# Altium schematic sheet GMSL_SERIALIZER.SchDoc
size C; SheetNumber: 2; SheetTotal: 4
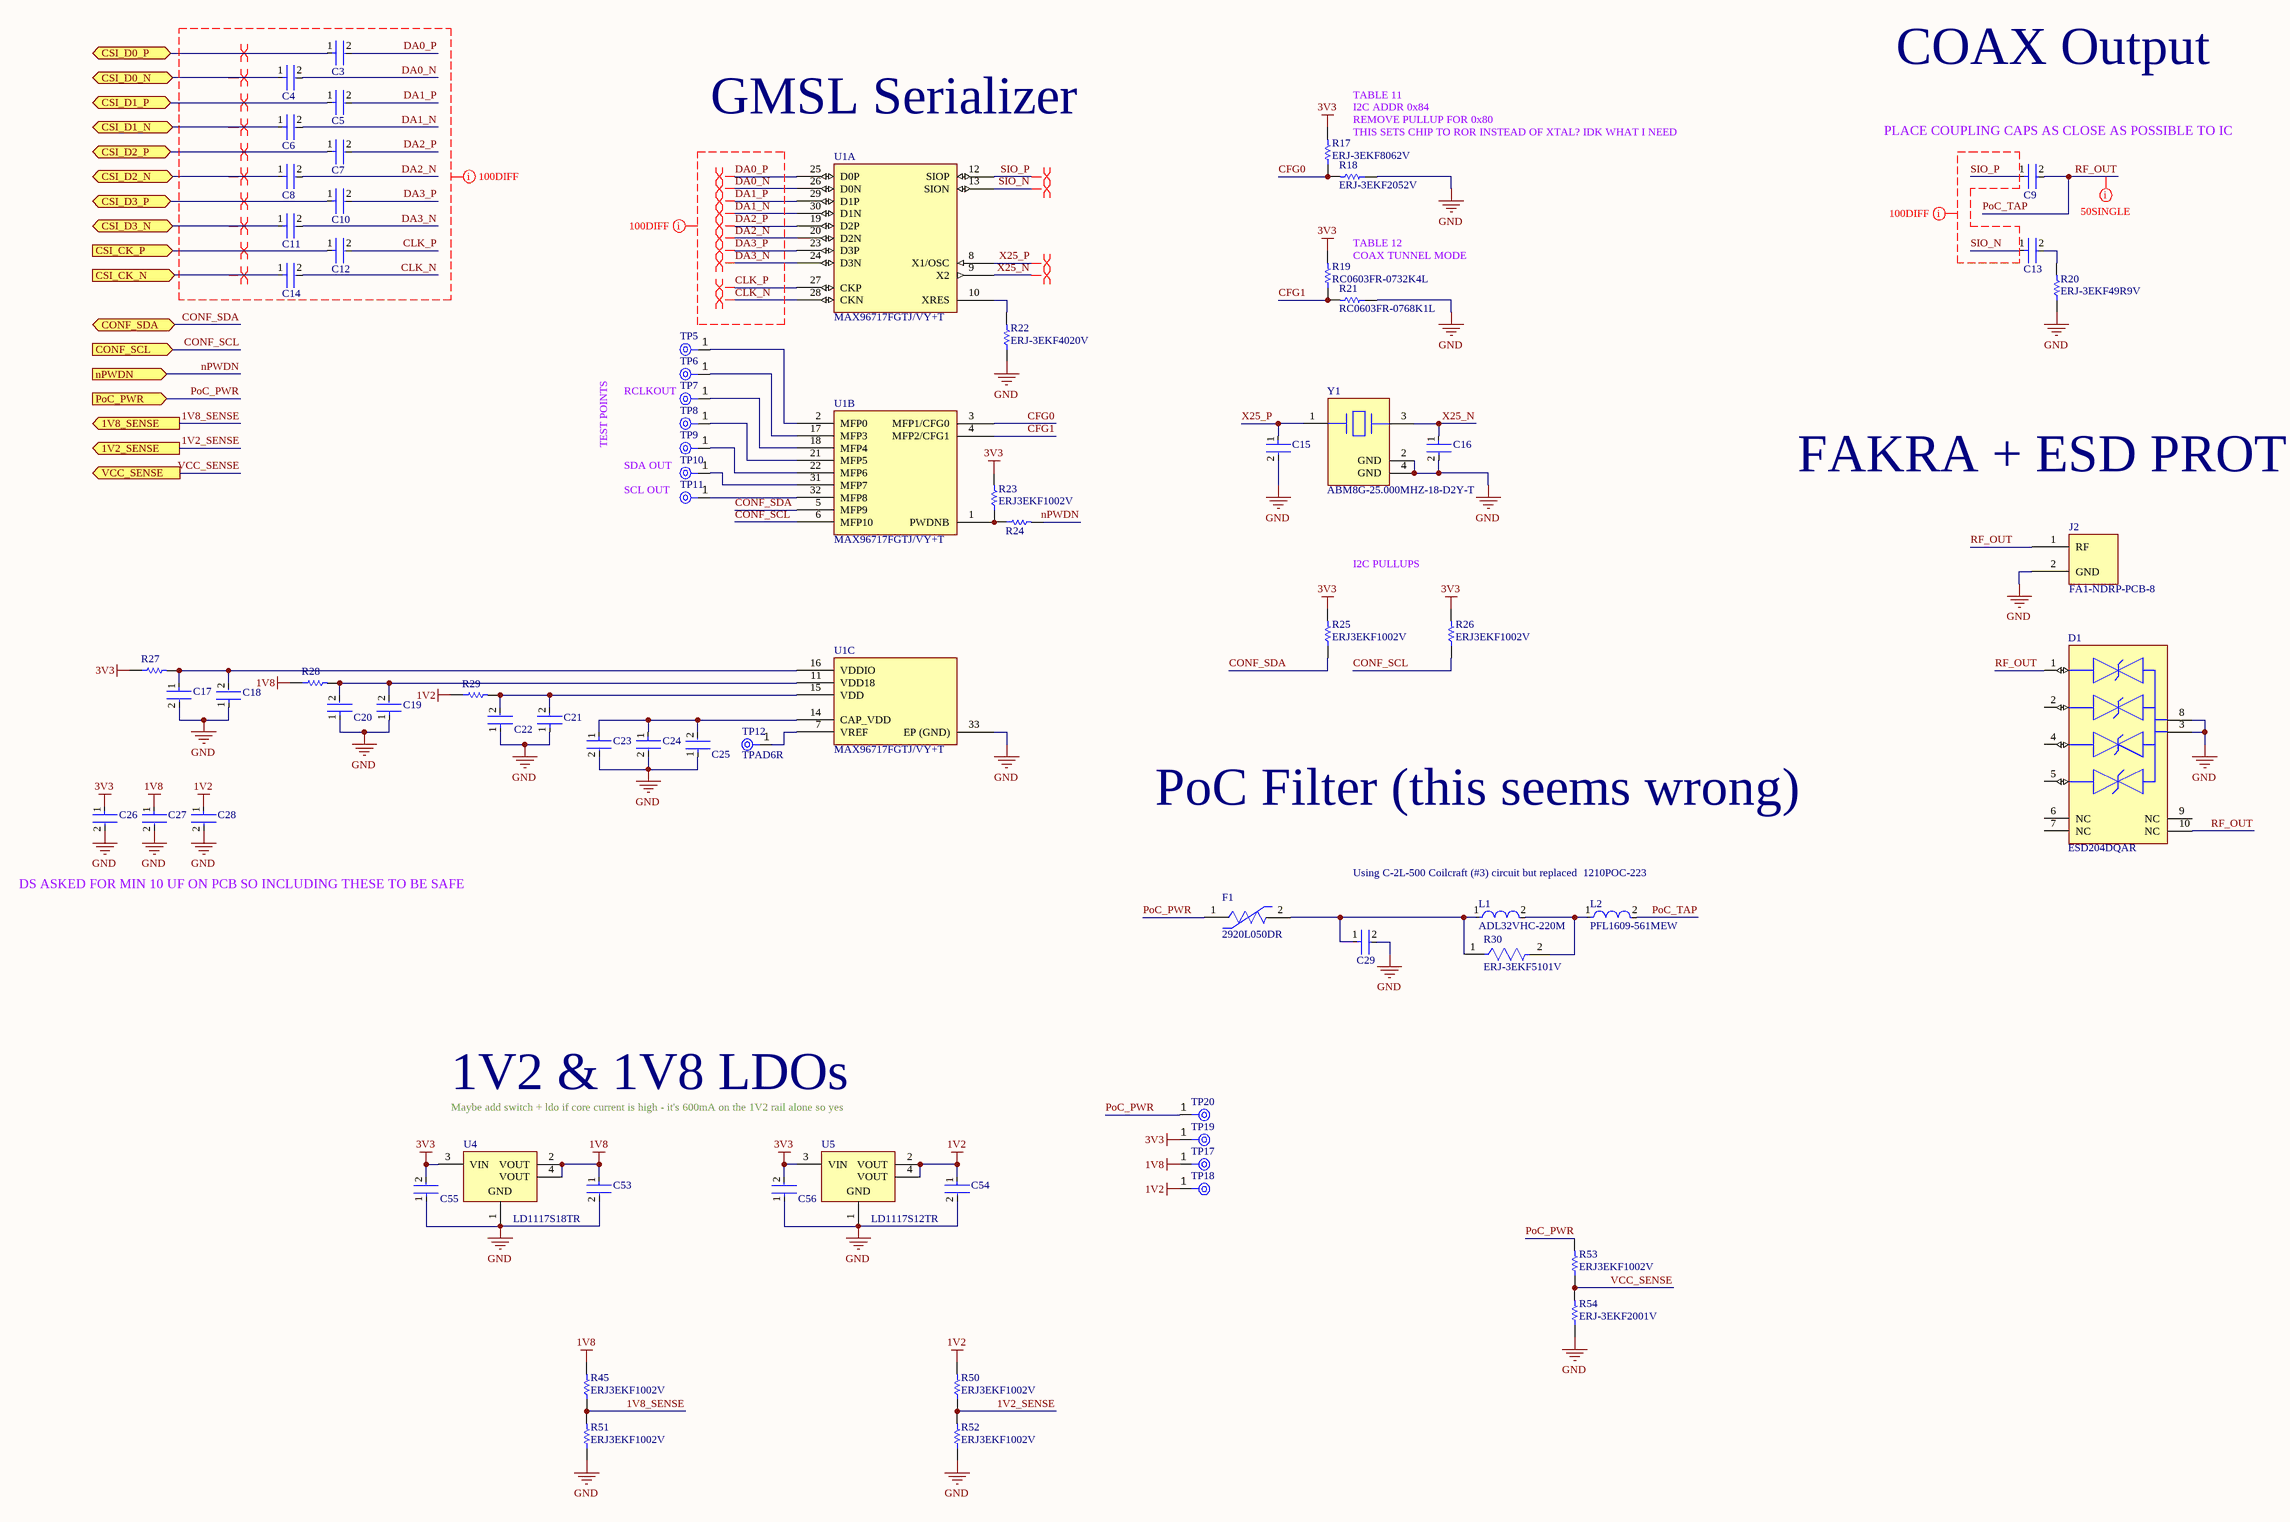
[diagram p0: GMSL_SERIALIZER.SchDoc]

## Parts
C3  C1005X7R1H104K050BB  [FP-C1005-050-0_05-IPC_C]  (value not drawn)
C4  C1005X7R1H104K050BB  [FP-C1005-050-0_05-IPC_C]  (value not drawn)
C5  C1005X7R1H104K050BB  [FP-C1005-050-0_05-IPC_C]  (value not drawn)
C6  C1005X7R1H104K050BB  [FP-C1005-050-0_05-IPC_C]  (value not drawn)
C7  C1005X7R1H104K050BB  [FP-C1005-050-0_05-IPC_C]  (value not drawn)
C8  C1005X7R1H104K050BB  [FP-C1005-050-0_05-IPC_C]  (value not drawn)
C9  C1005X7R1H104K050BB  [FP-C1005-050-0_05-IPC_C]  (value not drawn)
C10  C1005X7R1H104K050BB  [FP-C1005-050-0_05-IPC_C]  (value not drawn)
C11  C1005X7R1H104K050BB  [FP-C1005-050-0_05-IPC_C]  (value not drawn)
C12  C1005X7R1H104K050BB  [FP-C1005-050-0_05-IPC_C]  (value not drawn)
C13  C1005X7R1H104K050BB  [FP-C1005-050-0_05-IPC_C]  (value not drawn)
C14  C1005X7R1H104K050BB  [FP-C1005-050-0_05-IPC_C]  (value not drawn)
C15  C0603C300J5GACTU  [FP-C0603C-CF-MFG]  (value not drawn)
C16  C0603C300J5GACTU  [FP-C0603C-CF-MFG]  (value not drawn)
C17  CL05A106MP5NUNC  [FP-CL05A106MP5NUNC-MFG]  (value not drawn)
C18  C0402C103M5RACTU  [FP-C0402-BB-MFG]  (value not drawn)
C19  C0402C103M5RACTU  [FP-C0402-BB-MFG]  (value not drawn)
C20  C1005X7R1H104K050BB  [FP-C1005-050-0_05-IPC_C]  (value not drawn)
C21  C0402C103M5RACTU  [FP-C0402-BB-MFG]  (value not drawn)
C22  C1005X7R1H104K050BB  [FP-C1005-050-0_05-IPC_C]  (value not drawn)
C23  CL05A106MP5NUNC  [FP-CL05A106MP5NUNC-MFG]  (value not drawn)
C24  CL05A106MP5NUNC  [FP-CL05A106MP5NUNC-MFG]  (value not drawn)
C25  C1005X7R1H104K050BB  [FP-C1005-050-0_05-IPC_C]  (value not drawn)
C26  CL05A106MP5NUNC  [FP-CL05A106MP5NUNC-MFG]  (value not drawn)
C27  CL05A106MP5NUNC  [FP-CL05A106MP5NUNC-MFG]  (value not drawn)
C28  CL05A106MP5NUNC  [FP-CL05A106MP5NUNC-MFG]  (value not drawn)
C29  GRM21BR61E226ME44L  [FP-GRM21B-0_2-e0_2_0_7-IPC_B]  (value not drawn)
C53  GRM188R60J106ME47D  [FP-GRM188-0_1-e0_2_0_55-IPC_A]  (value not drawn)
C54  GRM188R60J106ME47D  [FP-GRM188-0_1-e0_2_0_55-IPC_A]  (value not drawn)
C55  C1005X7R1H104K050BB  [FP-C1005-050-0_05-IPC_C]  (value not drawn)
C56  C1005X7R1H104K050BB  [FP-C1005-050-0_05-IPC_C]  (value not drawn)
D1  ESD204DQAR  [FP-DQA0010A-MFG]
F1  2920L050DR  [FP-2920L050DR-MFG]
J2  FA1-NDRP-PCB-8  [FA1-NDRP-PCB-8-Footprint-1]
L1  ADL32VHC-220M  [FP-1210POC-MFG]
L2  PFL1609-561MEW  [FP-PFL1609-MFG]
R17  ERJ-3EKF8062V  [RESC1608X55X30LL15T15]
R18  ERJ-3EKF2052V  [RESC1608X55X30NL15T15]
R19  RC0603FR-0732K4L  [RESC1608X55X25ML10T15]
R20  ERJ-3EKF49R9V  [RESC1608X55X30ML15T15]
R21  RC0603FR-0768K1L  [RESC1608X55X25LL10T15]
R22  ERJ-3EKF4020V  [RESC1608X55X30LL15T15]
R23  ERJ3EKF1002V  [RESC1609X55X30LL15T15]
R24  0402 JUMPER  [RESC1005X40X25ML05T05]  (value not drawn)
R25  ERJ3EKF1002V  [RESC1609X55X30LL15T15]
R26  ERJ3EKF1002V  [RESC1609X55X30LL15T15]
R27  RC0402JR-070RL  [RESC1005X40X25NL05T10]  (value not drawn)
R28  RC0402JR-070RL  [RESC1005X40X25NL05T10]  (value not drawn)
R29  RC0402JR-070RL  [RESC1005X40X25NL05T10]  (value not drawn)
R30  ERJ-3EKF5101V  [FP-ERJ3EK-MFG]
R45  ERJ3EKF1002V  [RESC1609X55X30LL15T15]
R50  ERJ3EKF1002V  [RESC1609X55X30LL15T15]
R51  ERJ3EKF1002V  [RESC1609X55X30LL15T15]
R52  ERJ3EKF1002V  [RESC1609X55X30LL15T15]
R53  ERJ3EKF1002V  [RESC1609X55X30LL15T15]
R54  ERJ-3EKF2001V  [RESC1608X55X30ML15T15]
TP5  TPAD6R  [New footprint 1]  (value not drawn)
TP6  TPAD6R  [New footprint 1]  (value not drawn)
TP7  TPAD6R  [New footprint 1]  (value not drawn)
TP8  TPAD6R  [New footprint 1]  (value not drawn)
TP9  TPAD6R  [New footprint 1]  (value not drawn)
TP10  TPAD6R  [New footprint 1]  (value not drawn)
TP11  TPAD6R  [New footprint 1]  (value not drawn)
TP12  TPAD6R  [New footprint 1]
TP17  TPAD6R  [New footprint 1]  (value not drawn)
TP18  TPAD6R  [New footprint 1]  (value not drawn)
TP19  TPAD6R  [New footprint 1]  (value not drawn)
TP20  TPAD6R  [New footprint 1]  (value not drawn)
U1  MAX96717FGTJ/VY+T  [QFN50P500X500X80_HS-33N]  (parts A,B,C of 3)
U4  LD1117S18TR  [SOT-223_M]
U5  LD1117S12TR  [SOT-223_M]
Y1  ABM8G-25.000MHZ-18-D2Y-T  [FP-ABM8G-MFG]

## Ports
1V2_SENSE (out, see CamLink[4B], CONFIG_MCU[6A]), 1V8_SENSE (out, see CamLink[4B], CONFIG_MCU[6A]), CONF_SCL (in, see CamLink[4B]), CONF_SDA (bidir, see CamLink[4B]), CSI_CK_N (in, see CamLink[4B]), CSI_CK_P (in, see CamLink[4B]), CSI_D0_N (bidir, see CamLink[4A]), CSI_D0_P (bidir, see CamLink[4A]), CSI_D1_N (bidir, see CamLink[4A]), CSI_D1_P (bidir, see CamLink[4A]), CSI_D2_N (bidir, see CamLink[4A]), CSI_D2_P (bidir, see CamLink[4A]), CSI_D3_N (bidir, see CamLink[4A]), CSI_D3_P (bidir, see CamLink[4A]), nPWDN (in, see CamLink[4B]), PoC_PWR (in, see CamLink[4B]), VCC_SENSE (out, see CamLink[4B], CONFIG_MCU[6A])

## Nets
1V2: C28.1 C54.1 R29.1 R50.2 TP18.1(TP) U5.2(VOUT) U5.4(VOUT)
1V8: C27.1 C53.1 R28.1 R45.2 TP17.1(TP) U4.2(VOUT) U4.4(VOUT)
3V3: C26.1 C55.2 C56.2 R17.2 R19.2 R23.2 R25.2 R26.2 R27.1 TP19.1(TP) U4.3(VIN) U5.3(VIN)
GND: C15.2 C16.2 C17.2 C18.1 C19.1 C20.1 C21.1 C22.1 C23.2 C24.2 C25.1 C26.2 C27.2 C28.2 C29.2 C53.2 C54.2 C55.1 C56.1 D1.3(GND) D1.8(GND) J2.2(GND) R18.1 R20.1 R21.1 R22.1 R51.1 R52.1 R54.1 U1.33(EP_(GND)) U4.1(GND) U5.1(GND) Y1.2(GND) Y1.4(GND)
1V2_SENSE: R50.1 R52.2 ; port 1V2_SENSE
1V8_SENSE: R45.1 R51.2 ; port 1V8_SENSE
CFG0: R17.1 R18.2 U1.3(MFP1/CFG0)
CFG1: R19.1 R21.2 U1.4(MFP2/CFG1)
CLK_N: C14.2 U1.28(CKN)
CLK_P: C12.2 U1.27(CKP)
CONF_SCL: R26.1 U1.6(MFP10) ; port CONF_SCL
CONF_SDA: R25.1 U1.5(MFP9) ; port CONF_SDA
CSI_CK_N: C14.1 ; port CSI_CK_N
CSI_CK_P: C12.1 ; port CSI_CK_P
CSI_D0_N: C4.1 ; port CSI_D0_N
CSI_D0_P: C3.1 ; port CSI_D0_P
CSI_D1_N: C6.1 ; port CSI_D1_N
CSI_D1_P: C5.1 ; port CSI_D1_P
CSI_D2_N: C8.1 ; port CSI_D2_N
CSI_D2_P: C7.1 ; port CSI_D2_P
CSI_D3_N: C11.1 ; port CSI_D3_N
CSI_D3_P: C10.1 ; port CSI_D3_P
DA0_N: C4.2 U1.26(D0N)
DA0_P: C3.2 U1.25(D0P)
DA1_N: C6.2 U1.30(D1N)
DA1_P: C5.2 U1.29(D1P)
DA2_N: C8.2 U1.20(D2N)
DA2_P: C7.2 U1.19(D2P)
DA3_N: C11.2 U1.24(D3N)
DA3_P: C10.2 U1.23(D3P)
nPWDN: R24.2 ; port nPWDN
PoC_PWR: F1.1 R53.2 TP20.1(TP) ; port PoC_PWR
PoC_TAP: C9.2 D1.1(IO1) D1.10(NC) J2.1(RF) L2.2  [also labelled RF_OUT]
SIO_N: C13.1 U1.13(SION)
SIO_P: C9.1 U1.12(SIOP)
VCC_SENSE: R53.1 R54.2 ; port VCC_SENSE
X25_N: C16.1 U1.9(X2) Y1.3
X25_P: C15.1 U1.8(X1/OSC) Y1.1
NetC13_2: C13.2 R20.2
NetC17_1: C17.1 C18.2 R27.2 U1.16(VDDIO)
NetC19_2: C19.2 C20.2 R28.2 U1.11(VDD18)
NetC21_2: C21.2 C22.2 R29.2 U1.15(VDD)
NetC23_1: C23.1 C24.1 C25.2 U1.14(CAP_VDD)
NetC29_1: C29.1 F1.2 L1.1 R30.1
NetL1_2: L1.2 L2.1 R30.2
NetR22_2: R22.2 U1.10(XRES)
NetR23_1: R23.1 R24.1 U1.1(PWDNB)
NetTP5_1: TP5.1(TP) U1.2(MFP0)
NetTP6_1: TP6.1(TP) U1.17(MFP3)
NetTP7_1: TP7.1(TP) U1.18(MFP4)
NetTP8_1: TP8.1(TP) U1.21(MFP5)
NetTP9_1: TP9.1(TP) U1.22(MFP6)
NetTP10_1: TP10.1(TP) U1.31(MFP7)
NetTP11_1: TP11.1(TP) U1.32(MFP8)
NetTP12_1: TP12.1(TP) U1.7(VREF)

Not connected (* = marked no-connect by the designer): D1 2(IO2) 4(IO3) 5(IO4) 6(NC) 7(NC) 9(NC)

## Layout directives
net class 100DIFF: CLK_N, CLK_P, DA0_N, DA0_P, DA1_N, DA1_P, DA2_N, DA2_P, DA3_N, DA3_P, SIO_N, SIO_P
differential pair: CLK_N, CLK_P, CSI_CK_N, CSI_CK_P, CSI_D0_N, CSI_D0_P, CSI_D1_N, CSI_D1_P, CSI_D2_N, CSI_D2_P, CSI_D3_N, CSI_D3_P, DA0_N, DA0_P, DA1_N, DA1_P, DA2_N, DA2_P, DA3_N, DA3_P, SIO_N, SIO_P, X25_N, X25_P
net class 50SINGLE: PoC_TAP

## Notes on the sheet
- COAX Output
- GMSL Serializer
- (near R17) I2C ADDR 0x84
- (near R17) REMOVE PULLUP FOR 0x80
- THIS SETS CHIP TO ROR INSTEAD OF XTAL? IDK WHAT I NEED
- (near R17) TABLE 11
- (near C9) PLACE COUPLING CAPS AS CLOSE AS POSSIBLE TO IC
- COAX TUNNEL MODE
- (near R19) TABLE 12
- TEST POINTS
- RCLKOUT
- SDA OUT
- SCL OUT
- FAKRA + ESD PROT
- I2C PULLUPS
- PoC Filter (this seems wrong)
- Using C-2L-500 Coilcraft (#3) circuit but replaced  1210POC-223
- DS ASKED FOR MIN 10 UF ON PCB SO INCLUDING THESE TO BE SAFE
- 1V2 & 1V8 LDOs
- Maybe add switch + ldo if core current is high - it's 600mA on the 1V2 rail alone so yes

## Library data of the parts
C3-C14 C20 C22 C25 C55 C56 = CMP-2000-05393-2: Multilayer Ceramic Capacitors 100nF ±10% 50V X7R SMD 0402; Voltage: 50V; Dielectric Material: Ceramic; Min Operating Temperature: -55°C; Depth: 0.5mm; Radiation Hardening: No; RoHS Compliant: Yes; Voltage Rating (DC): 50V; Lead Free: Lead Free; Resistor Type: Ceramic; Height: 0.5mm; Dielectric: X7R; Thickness: 0.022inch; Case/Package: 0402; Case Code (Metric): 1005; Termination: SMD/SMT; Capacitance: 100nF; Packaging: Tape and Reel; Max Operating Temperature: 125°C; Mount: Surface Mount; Package Quantity: 1; Width: 0.02inch; Weight: 2.3E-05oz; Voltage Rating: 50V; Tolerance: 10%; Construction: Flat; Case Code (Imperial): 0402; Length: 1mm; REACH SVHC: No SVHC; Series: C
C15 C16 = CMP-1035-00914-3: CAP CER 30PF 50V 5% NP0 0603; Manufacturer: KEMET; Automotive Grade: Grade 1; Temperature Coefficient: 30ppm/°C; Material: Ceramic; Temperature Characteristic: C0G; Tolerance: 0.05; Manufacturer Part Number: C0603C300J5GACTU; ComponentLink2URL: https://api.kemet.com/component-edge/download/datasheet/C0603C100J5GACAUTO.pdf; Automotive: Yes; Device Class L2: Capacitors; Device Class L1: Passive Components; Device Class L3: Ceramic Capacitors; RoHS: TRUE; Octopart: https://octopart.com/c0603c300j5gactu-kemet-199455; Lead Free: Yes; Value: 30 pF; Temperature Range High: +125°C; Category: Cap; Temperature: -55°C to +125°C; Package: C0603C-CF; Capacitance: 30 pF; Digikey Description: CAP CER 30PF 50V 5% NP0 0603; Height: 0.87mm; ComponentLink2Description: Datasheet; Temperature Range Low: -55°C; Mouser Description: Multilayer Ceramic Capacitors MLCC - SMD/SMT 50volts 30pF C0G 5%; Voltage Rating: 50 V
C17 C23 C24 C26-C28 = CMP-13271-000002-1: CAP CER 10UF 10V X5R 0402; Manufacturer: Samsung; Temperature Coefficient: 15%; Tolerance: 20%; Material: Ceramic; Octopart: https://octopart.com/cl05a106mp5nunc-samsung-22457395; Voltage Rating: 10V; RoHS: TRUE; Value: 10uF; Height: 0.7mm; Digikey Description: CAP CER 10UF 10V X5R 0402; Automotive: No; Package: CL05A106MP5NUNC; Device Class L1: Passive Components; Capacitance: 10uF; Temperature Range High: +85°C; ComponentLink2Description: Datasheet; Device Class L2: Capacitors; Temperature Characteristic: X5R; Manufacturer Part Number: CL05A106MP5NUNC; Temperature: -55°C to +85°C; ComponentLink2URL: http://www.samsungsem.com/kr/support/product-search/mlcc/__icsFiles/afieldfile/2019/05/10/19-CL05A106MP5NUNC.pdf; Device Class L3: Ceramic Capacitors; Category: Cap; Temperature Range Low: -55°C; Ipc Land Pattern Name: CAPC10050X50; Lead Free: Yes
C18 C19 C21 = CMP-1034-01887-3: CAP CER 10000PF 50V 20% X7R 0402; Manufacturer: Kemet; Value: 10,000 pF; Tolerance: 0.2; Temperature Coefficient: 15%; Material: Ceramic; Temperature Range Low: -55°C; Digikey Description: CAP CER 10000PF 50V 20% X7R 0402; Temperature Characteristic: X7R; Device Class L2: Capacitors; RoHS: TRUE; Temperature Range High: +125°C; Mouser Description: Cap Ceramic 0.01uF 50V X7R 20% SMD 1.0 x 0.5 mm 125 C Paper T/R; Package: C0402-BB; ComponentLink2URL: https://content.kemet.com/datasheets/KEM_C1002_X7R_SMD.pdf; Device Class L1: Passive Components; ComponentLink2Description: Datasheet; Height: 0.55mm; Automotive: No; Temperature: -55°C to +125°C; Capacitance: 10,000 pF; Manufacturer Part Number: C0402C103M5RACTU; Device Class L3: Ceramic Capacitors; Voltage Rating: 50 V; Ipc Land Pattern Name: CAPC10050X50; Category: Cap; Octopart: https://octopart.com/c0402c103m5ractu-kemet-17125571; Lead Free: Yes
C29 = CMP-2007-03222-3: Chip Multilayer Ceramic Capacitors for General Purpose, 0805, 22uF, X5R, 15%, 20%, 25V; Case/Package: 0805; Depth: 1.25mm; Resistor Type: Ceramic; Voltage Rating: 25V; Lead Free: Lead Free; Voltage Rating (DC): 25V; Case Code (Metric): 2012; Thickness: 0.057inch; REACH SVHC: No SVHC; Material: Ceramic; Tolerance: 20%; Length: 2mm; Capacitance: 22uF; Case Code (Imperial): 0805; Max Operating Temperature: 85°C; Termination: SMD/SMT; Weight: 0.000335oz; Dielectric: X5R; Packaging: Tape and Reel; Voltage: 25V; Package Quantity: 3000; Height: 1.25mm; Mount: Surface Mount; Width: 1.25mm; Min Operating Temperature: -55°C
C53 C54 = CMP-2006-02792-2: Chip Multilayer Ceramic Capacitors for General Purpose, 0603, 10uF, X5R, 15%, 20%, 6.3V; Packaging: Tape and Reel; Voltage Rating (DC): 6.3V; Width: 0.031inch; Termination: SMD/SMT; Dielectric: X5R; Package Quantity: 4000; Voltage Rating: 6.3V; Capacitance: 10uF; Case/Package: 0603; Min Operating Temperature: -55°C; Voltage: 6.3V; Length: 1.6mm; Thickness: 0.035inch; Lead Free: Lead Free; Depth: 0.8mm; Case Code (Imperial): 0603; Max Operating Temperature: 85°C; Material: Ceramic; Height: 0.8mm; Tolerance: 20%; Mount: Surface Mount; REACH SVHC: No SVHC; Radiation Hardening: No; Case Code (Metric): 1608
D1 = CMP-04989-000002-1: 4-CHANNEL LOW-CAPACITANCE SURGE; Manufacturer: Texas Instruments; Value: 0.55pF; Reverse Standoff Voltage: 3.6V; Standoff Height: 0mm; Breakdown Voltage: 5.5V; Peak Pulse Current: 5.5A; Clamping Voltage: 11.5V; Direction: Bidirectional; Peak Pulse Power: 50W; Number Of Channels: 4; Ambient Temperature Range High: +125°C; ComponentLink2Description: Datasheet; Height: 0.55mm; Lead Free: Yes; Device Class L3: unset; Temperature Range High: +125°C; Temperature Range Low: -40°C; Package: DQA0010A; Temperature: -40°C to +125°C; Capacitance: 0.55pF; RoHS: TRUE; Mouser Description: 4-Channel Low-Capacitance Surge and ESD Protection Diode 10-USON -40 to 125; Category: Diode; Device Class L1: Circuit Protection; Octopart: https://octopart.com/esd204dqar-texas+instruments-89917476; Device Class L2: TVS Diodes; Ambient Temperature Range Low: -40°C; Manufacturer Part Number: ESD204DQAR; ComponentLink2URL: http://www.ti.com/lit/ds/symlink/esd204.pdf; Automotive: No; Digikey Description: 4-CHANNEL LOW-CAPACITANCE SURGE
F1 = CMP-08606-000071-1: PTC RESET FUSE 60V 500MA 2920; Resistance: 1.4R; Trip Current: 1A; Power Dissipation: 1.5W; Time to Trip: 4s; Approvals: cULus; Current Rating: 10A; Operating Supply Voltage: 60V; Termination: SMD/SMT; Width: 5.44mm; Case/Package: 2920; Series: 2920L; Case Code (Imperial): 2920; Height: 1.25mm; Hold Current: 500mA; Terminal Material: Copper; Min Operating Temperature: -40°C; Package Quantity: 1500; Max Voltage Rating (DC): 60V; RoHS Compliant: Yes; Case Code (Metric): 7351; Lead Free: Lead Free; Max Operating Temperature: 85°C; Voltage Rating (DC): 60V; Working Voltage: 60V; Length: 7.98mm; REACH SVHC: No SVHC; Max Current Rating: 10A; Voltage Rating: 60V; Packaging: Tape and Reel
J2 = CMP-002-00054-1: RF F Connector, Male, Board Mount, Solder Terminal, Plug; Connector Type: RF F CONNECTOR; RoHS Compliant: Yes; Mounting Technology: Board
L1 = CMP-11268-000041-1: NOT COILCRAFT - ACTUAL P# --> ADL32VHC-220M / - Power Injection Chokes for PoC; Manufacturer Part Number: 1210POC-223MRC; Value: 22uH; Core Material: Ferrite; Saturation Current: 720mA; Series Resistance: 0.88Ω; Rms Current: 700mA; Automotive Grade: Grade 1; Self Resonant Frequency: 70MHz; Test Frequency: 100kHz; Tolerance: 20%; Ambient Temperature Range High: +125°C; Manufacturer: coilcraft; Octopart: https://octopart.com/1210poc-223mrc-coilcraft-103207315; Category: Ind; Device Class L2: Inductors; RoHS: TRUE; Device Class L3: Fixed Inductors; Package: 1210POC; Ambient Temperature Range Low: -40°C; ComponentLink2URL: https://drive.google.com/open?id=15FlOq8Y4YbRFohfA_cJ40jgnqs8va2Mh; Lead Free: Yes; Inductance: 22uH; Device Class L1: Passive Components; ComponentLink2Description: Datasheet; Automotive: Yes; Height: 3mm
L2 = CMP-11268-000007-1: Fixed Inductors PFL1609 Low Profile 0.56 uH 20 % 1.4 A; Manufacturer: coilcraft; Rms Current: 1100mA; Self Resonant Frequency: 600MHz; Core Material: Composite; Tolerance: 20%; Value: 0.56uH; Automotive Grade: Grade 1; Saturation Current: 710mA; Test Frequency: 7.9MHz; Shielding: true; Series Resistance: 130mΩ; Lead Free: Yes; Device Class L1: Passive Components; Package: PFL1609; Octopart: https://octopart.com/pfl1609-561mew-coilcraft-20329171; ComponentLink2URL: https://www.coilcraft.com/pdfs/pfl1609.pdf; Manufacturer Part Number: PFL1609-561MEW; Ambient Temperature Range Low: -40°C; Composition: Wirewound; Inductance: 0.56uH; Device Class L2: Inductors; Category: Ind; Device Class L3: Fixed Inductors; Mouser Description: Fixed Inductors PFL1609 Low Profile 0.56 uH 20 % 1.4 A; Automotive: Yes; ComponentLink2Description: Datasheet; Ambient Temperature Range High: +105°C; Height: 0.95mm; RoHS: TRUE
R17 = CMP-2000-00651-1: Manufacturer: Panasonic; Part Number: ERJ-3EKF8062V
R18 = CMP-2000-00323-1: Manufacturer: Panasonic; Part Number: ERJ-3EKF2052V
R19 = CMP-2000-04011-1: Manufacturer: Yageo; Part Number: RC0603FR-0732K4L
R20 = CMP-2000-00538-1: Manufacturer: Panasonic; Part Number: ERJ-3EKF49R9V
R21 = CMP-2000-04112-1: Manufacturer: Yageo; Part Number: RC0603FR-0768K1L
R22 = CMP-2000-00484-1: Manufacturer: Panasonic; Part Number: ERJ-3EKF4020V
R23 R25 R26 R45 R50-R53 = CMP-1012-00623-3: Chip Resistor, 10 KOhm, +/- 1%, 0.1 W, -55 to 155 degC, 0603 (1608 Metric), RoHS, Tape and Reel; Manufacturer: Panasonic; Voltage Rating: 75V; Case\/Package: 0603; Power Rating: 100mW; Resistance: 10KOhm; Temperature Coefficient: 100ppm\/degreesC; Number of Pins: 2; Package Reference: 603; Depth: 0.8mm; Mount: SurfaceMount; Package Description: 2-Pin Surface Mount Device, Body 1.6 x 0.85 mm; Datasheet Version: 02/2017; Length: 1.6mm; Lead Free: LeadFree; Height: 0.45mm; Number of Terminations: 2; Max Power Dissipation: 100mW; Min Operating Temperature: -55degC; Datasheet URL: https://industrial.panasonic.com/cdbs/www-data/pdf/RDA0000/AOA0000C304.pdf; Termination: SMD/SMT; Case Code (Metric): 1608; Case Code (Imperial): 0603; Tolerance: 1%; Max Operating Temperature: 155degC; RoHSCompliant: true; Voltage Rating (DC): 75V; Radiation Hardening: No; Packaging: TapeandReel; Composition: ThickFilm; Mounting Technology: SurfaceMount; Manufacturer URL: http://www.panasonic.com/; Width: 0.031inch; REACH SVHC: NoSVHC; Contact Plating: Tin; Military Standard: Not; Package Quantity: 1
R24 = CMP-009-00118-2: READ THE NAME; Pins: 2; Component Type: Standard; Design Item ID: CMP-009-00206-2; Source: 0402jump.SchLib
R27-R29 = CMP-1011-00001-2: Manufacturer: Yageo / Phycomp; Part Number: RC0402JR-070RL
R30 = CMP-2000-00540-8: RES SMD 5.1K OHM 1% 1/10W 0603; Power Rating: 100mW; Temperature Coefficient: 100ppm/°C; Voltage Rating: 75V; Resistance: 5.1kR; Military Standard: Not; Case/Package: 0603; Packaging: Tape and Reel; Package Quantity: 1; Reach SVHC Compliant: Yes; Lead Free: Lead Free; Mount: Surface Mount; Size Code: 0603; Depth: 0.8mm; Resistance Tolerance: 1%; Number of Terminations: 2; Resistor Type: Thick Film; Width: 0.8mm; Construction: Rectangular; Series: ERJ; Radiation Hardening: No; Max Operating Temperature: 155°C; Features: Automotive AEC-Q200; Tolerance: 1%; Voltage Rating (DC): 75V; Length: 1.6mm; RoHS Compliant: Yes; Min Operating Temperature: -55°C; Case Code (Metric): 1608; Termination: SMD/SMT; Weight: 7.1E-05oz; Max Power Dissipation: 100mW; Contact Plating: Tin; Height: 0.022inch; Case Code (Imperial): 0603
R54 = CMP-2000-00317-1: Manufacturer: Panasonic; Part Number: ERJ-3EKF2001V
TP5-TP12 TP17-TP20 = CMP-00025-2: Test Point .6mm
U1 = CMP-015-00012-1: 3Gbps Serializer TQFN-32 Serializers / Deserializers ROHS
U4 = CMP-0244-00308-1: Fixed Low Drop Positive Voltage Regulator, 1.8V, 4-Pin SOT-223, Tape and Reel; ComponentLink1URL: http://www.st.com; PackageReference: SOT-223; PackageDescription: 4-Pin SOT-223 Package, 6.5 x 3.5 mm Body, 2.3 mm Pitch, 7 mm Lead Span; ComponentLink2URL: http://www.st.com/internet/com/TECHNICAL_RESOURCES/TECHNICAL_LITERATURE/DATASHEET/CD00000544.pdf; ComponentLink2Description: Datasheet; ComponentLink1Description: Manufacturer URL; DatasheetVersion: 1/11/2011; PackageVersion: 2010
U5 = CMP-0244-00318-1: Fixed Low Drop Positive Voltage Regulator, 1.2V, 4-Pin SOT-223, Tape and Reel; PackageDescription: 4-Pin SOT-223 Package, 6.5 x 3.5 mm Body, 2.3 mm Pitch, 7 mm Lead Span; PackageVersion: 2010; ComponentLink2Description: Datasheet; PackageReference: SOT-223; ComponentLink2URL: http://www.st.com/internet/com/TECHNICAL_RESOURCES/TECHNICAL_LITERATURE/DATASHEET/CD00000544.pdf; ComponentLink1Description: Manufacturer URL; DatasheetVersion: 1/11/2011; ComponentLink1URL: http://www.st.com
Y1 = CMP-2000-05733-3: Crystal 25MHz ±20ppm (Tol) ±30ppm (Stability) 18pF FUND 60Ω 4-Pin SMD T/R; Series Resistance: 60R; Length: 3.2mm; Depth: 2.5mm; Packaging: Tape and Reel; Min Operating Temperature: -40°C; Operating Frequency: 25 MHz; Lead Free: Lead Free; Number of Pins: 4; Frequency Tolerance: 20ppm; Radiation Hardening: No; Max Operating Temperature: 85°C; Termination: SMD/SMT; Frequency Stability: 30ppm; Frequency: 25MHz; Series: ABM8G; Mount: Surface Mount; Package Quantity: 1000; Height: 0.039inch; Width: 0.098inch; Case/Package: CSMD; ESR (Equivalent Series Resistance): 60R; Load Capacitance: 18pF; Tolerance: 20ppm